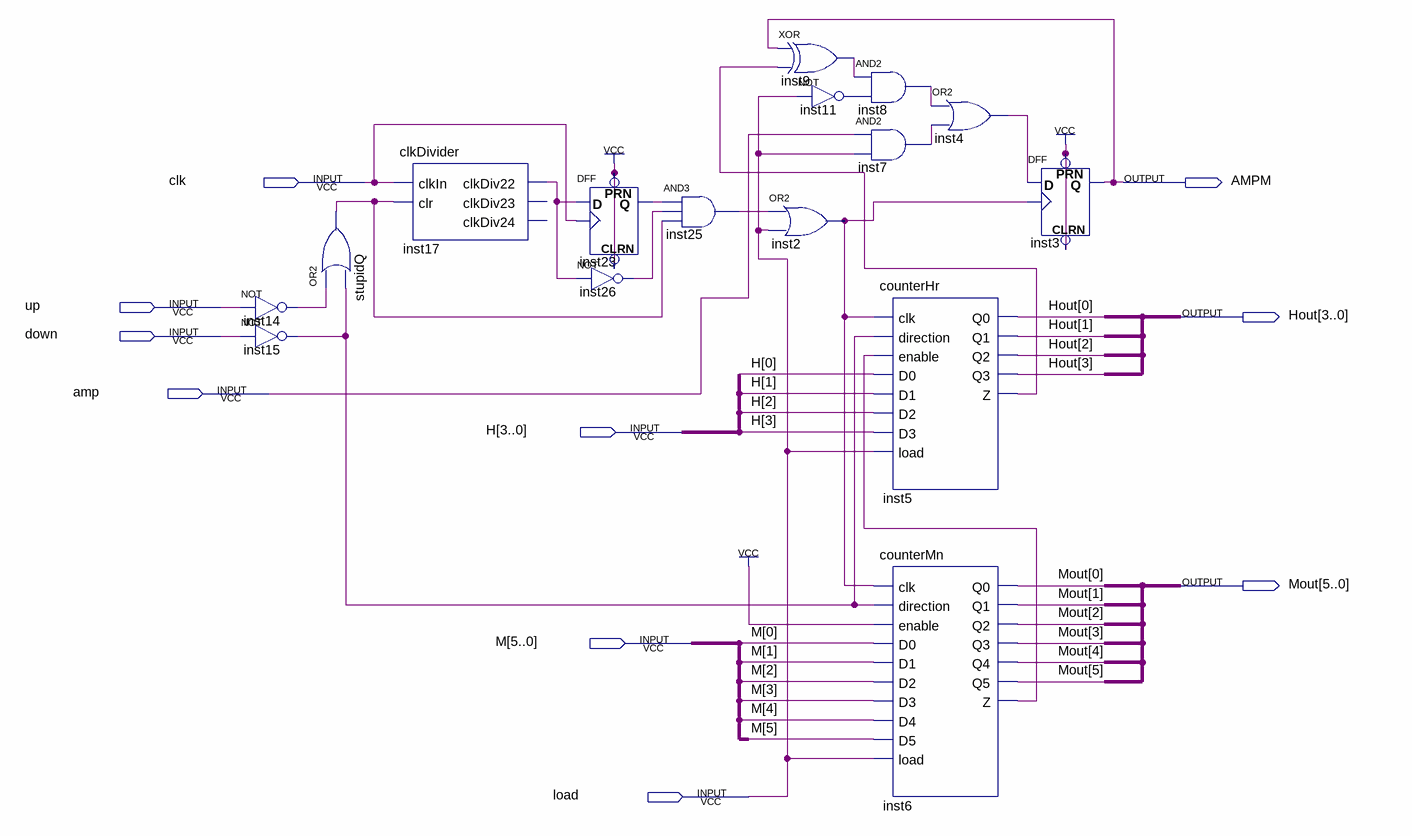
[diagram p0: schematic sheet]
// Quartus schematic upDownTime.bdf as structural Verilog: 16 symbols, 10 pins
module upDownTime (
  input  clk,
  input  up,
  input  down,
  input  amp,
  input  [3:0] H,
  input  [5:0] M,
  input  load,
  output AMPM,
  output [3:0] Hout,
  output [5:0] Mout
);

  wire inst2_out, inst4_out, inst5_z, inst6_z, inst7_out, inst8_out, inst9_out, inst11_out, inst14_out,
       inst15_out, inst17_clkdiv22, inst23_q, inst25_out, inst26_out, stupidQ_out;

  not inst14 (inst14_out, up);
  not inst15 (inst15_out, down);
  or stupidQ (stupidQ_out, inst14_out, inst15_out);
  clkDivider inst17 (.clkIn(clk), .clr(stupidQ_out), .clkDiv22(inst17_clkdiv22));  // open: clkDiv23, clkDiv24
  DFF inst23 (.CLRN(1'b1), .CLK(clk), .D(inst17_clkdiv22), .PRN(1'b1), .Q(inst23_q));
  not inst26 (inst26_out, inst17_clkdiv22);
  and inst25 (inst25_out, inst23_q, inst26_out, stupidQ_out);
  xor inst9 (inst9_out, AMPM, inst5_z);
  or inst2 (inst2_out, inst25_out, load);
  and inst8 (inst8_out, inst9_out, inst11_out);
  not inst11 (inst11_out, load);
  and inst7 (inst7_out, amp, load);
  or inst4 (inst4_out, inst8_out, inst7_out);
  counterHr inst5 (
    .clk(inst2_out), .direction(inst15_out), .enable(inst6_z), .D0(H[0]), .D1(H[1]), .D2(H[2]), .D3(H[3]),
    .load(load), .Q0(Hout[0]), .Q1(Hout[1]), .Q2(Hout[2]), .Q3(Hout[3]), .Z(inst5_z));
  counterMn inst6 (
    .clk(inst2_out), .direction(inst15_out), .enable(1'b1), .D0(M[0]), .D1(M[1]), .D2(M[2]), .D3(M[3]),
    .D4(M[4]), .D5(M[5]), .load(load), .Q0(Mout[0]), .Q1(Mout[1]), .Q2(Mout[2]), .Q3(Mout[3]), .Q4(Mout[4]),
    .Q5(Mout[5]), .Z(inst6_z));
  DFF inst3 (.CLRN(1'b1), .CLK(inst2_out), .D(inst4_out), .PRN(1'b1), .Q(AMPM));
endmodule
